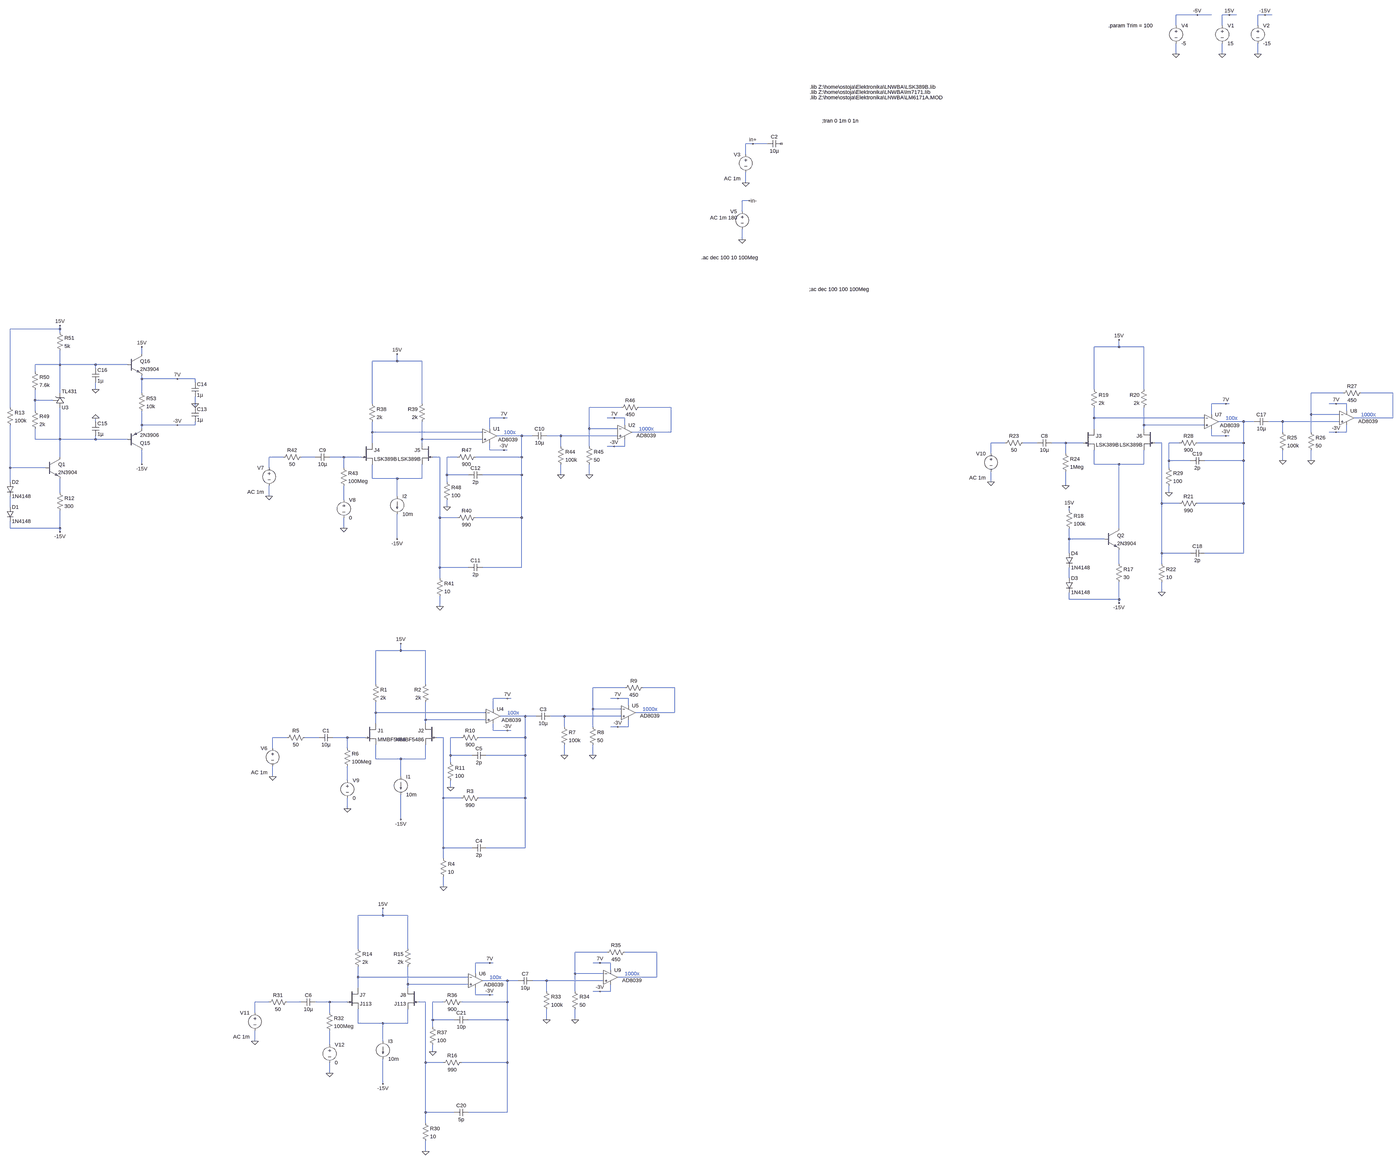
[diagram p0: schematic Figure_3.37.asc, whole sheet]
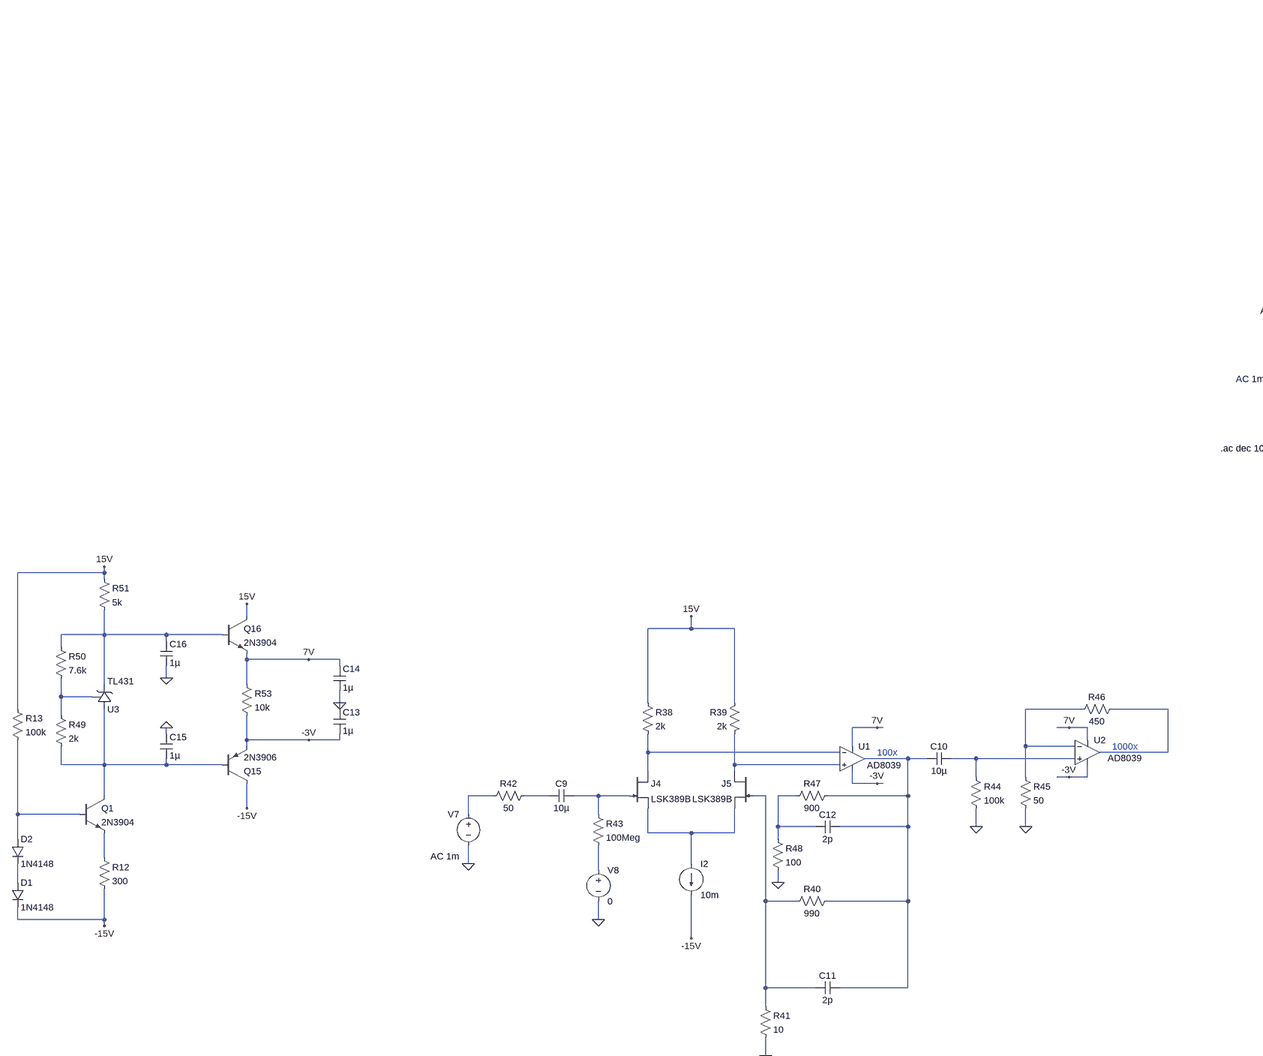
[diagram p1: schematic Figure_3.37.asc, part, row 1 of 2, column 1 of 2]
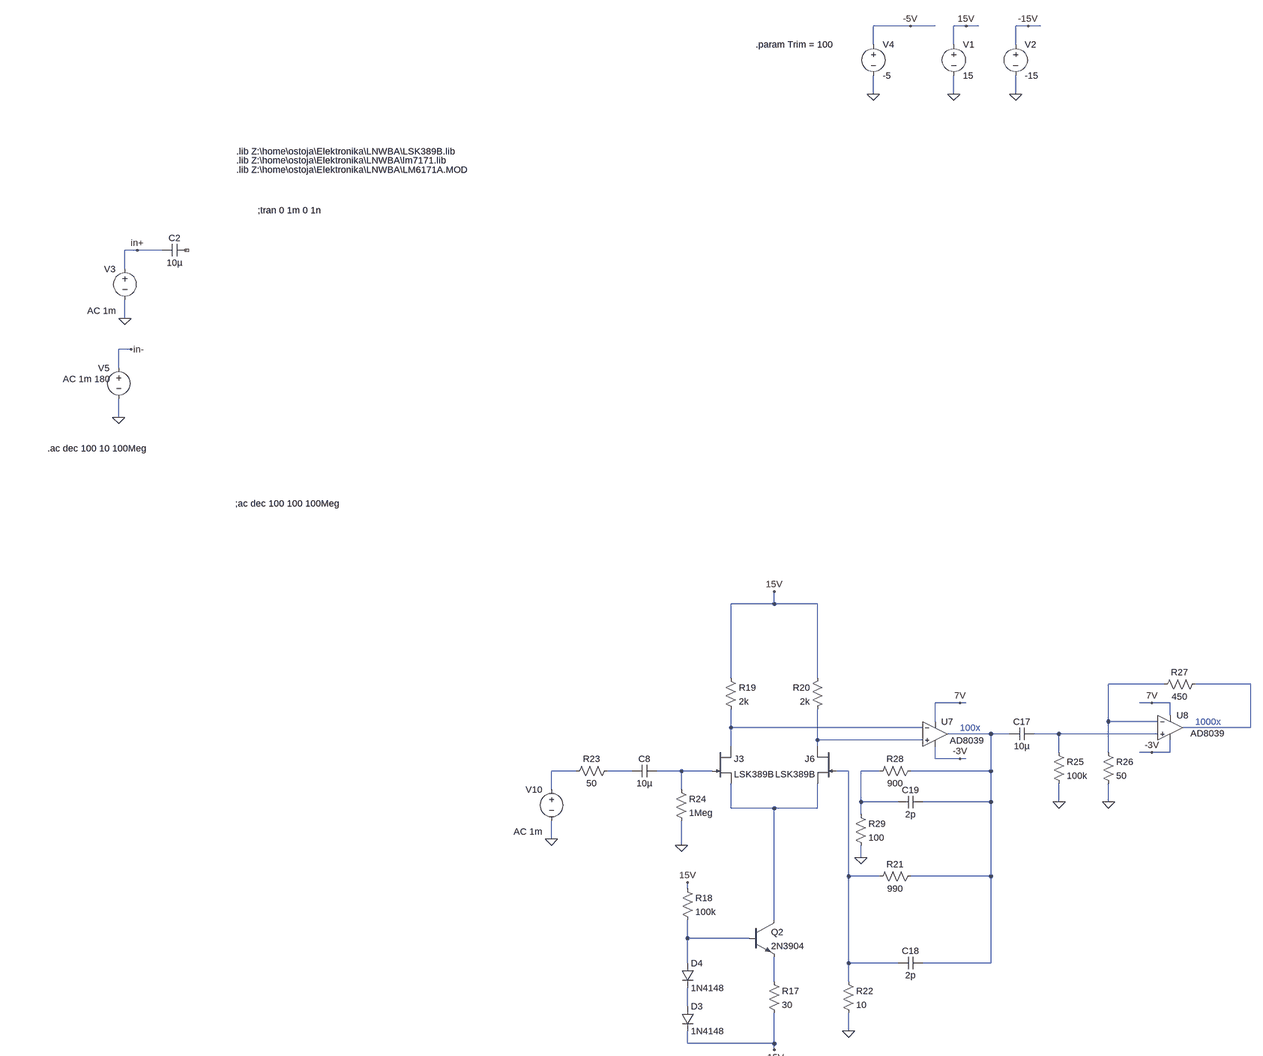
[diagram p2: schematic Figure_3.37.asc, part, row 1 of 2, column 2 of 2]
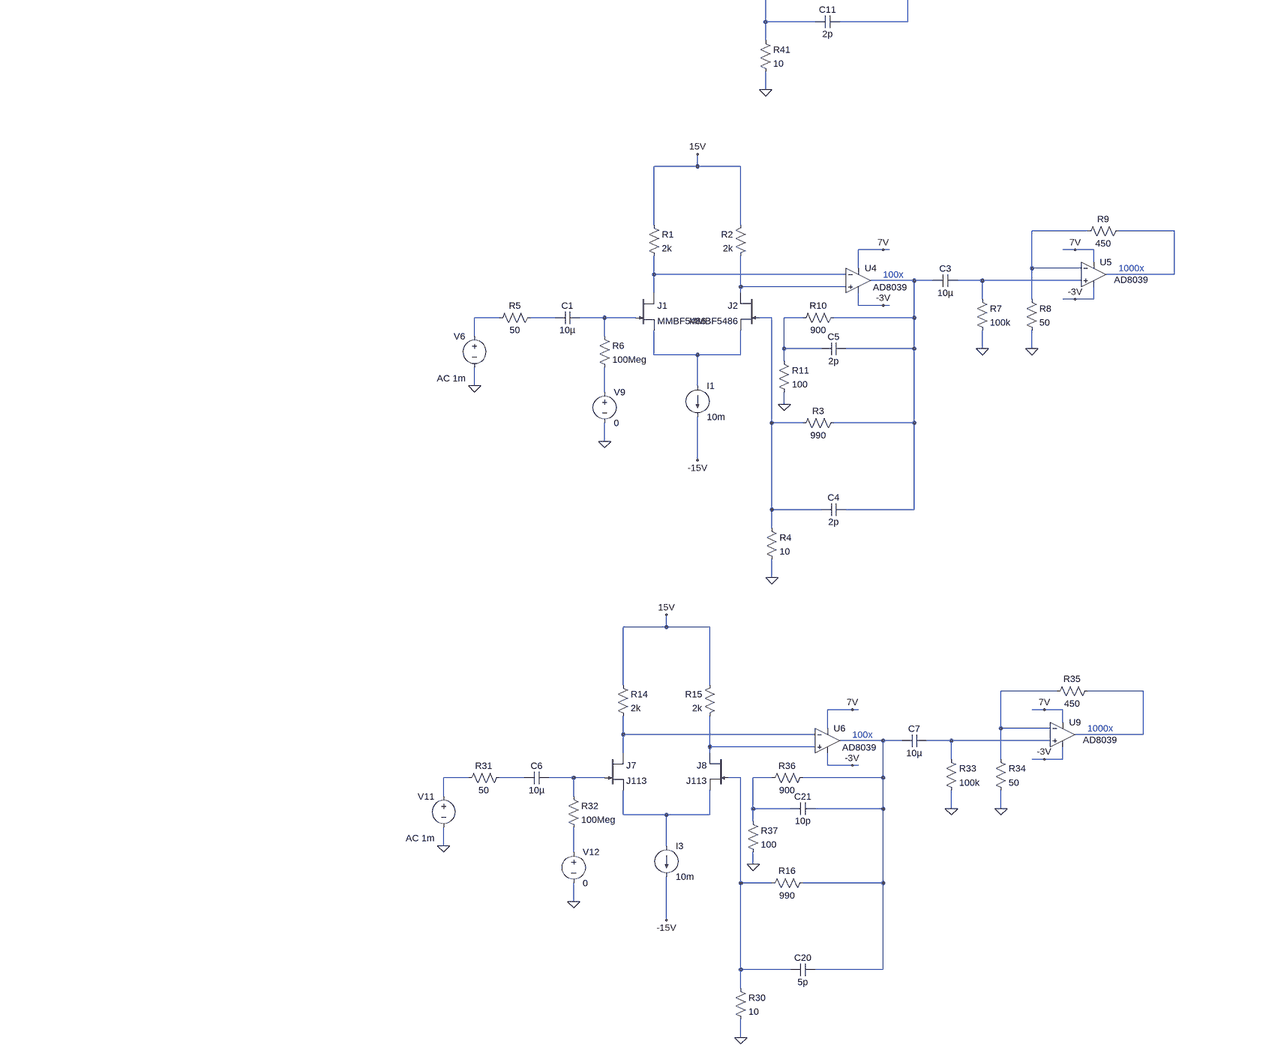
[diagram p3: schematic Figure_3.37.asc, part, row 2 of 2, column 1 of 2]
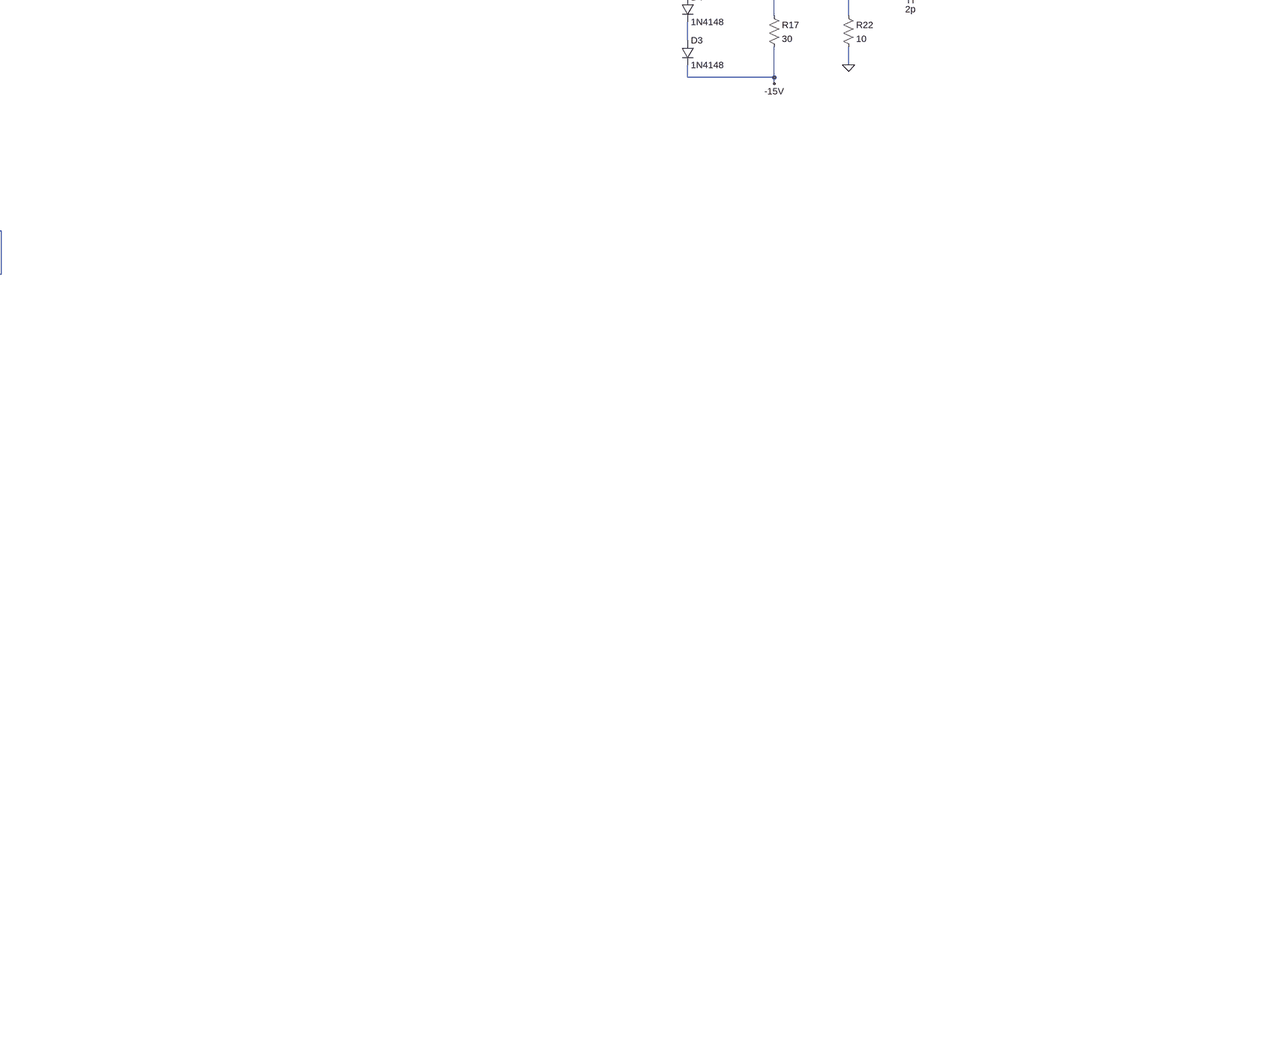
[diagram p4: schematic Figure_3.37.asc, part, row 2 of 2, column 2 of 2]
Figure_3.37.asc, the LTspice schematic file:
Version 4
SHEET 1 8100 7252
WIRE 960 -592 864 -592
WIRE 1024 -592 960 -592
WIRE 1104 -592 1072 -592
WIRE 1136 -592 1104 -592
WIRE 1264 -592 1232 -592
WIRE 1296 -592 1264 -592
WIRE 864 -544 864 -592
WIRE 1072 -544 1072 -592
WIRE 1232 -544 1232 -592
WIRE 864 -416 864 -464
WIRE 1072 -416 1072 -464
WIRE 1232 -416 1232 -464
WIRE -2000 32 -2032 32
WIRE -1936 32 -2000 32
WIRE -2032 80 -2032 32
WIRE -2032 208 -2032 160
WIRE -2016 288 -2048 288
WIRE -2048 336 -2048 288
WIRE -2048 464 -2048 416
WIRE -5424 3392 -5424 3376
WIRE -5424 3392 -5648 3392
WIRE -5424 3408 -5424 3392
WIRE 608 3472 608 3440
WIRE 608 3472 496 3472
WIRE 720 3472 608 3472
WIRE -5056 3504 -5056 3472
WIRE -3712 3536 -3712 3504
WIRE -3712 3536 -3824 3536
WIRE -3600 3536 -3712 3536
WIRE -5424 3552 -5424 3488
WIRE -5424 3552 -5536 3552
WIRE -5264 3552 -5424 3552
WIRE -5120 3552 -5264 3552
WIRE -5264 3568 -5264 3552
WIRE -5536 3584 -5536 3552
WIRE -5056 3616 -5056 3600
WIRE -4896 3616 -5056 3616
WIRE -4816 3616 -4896 3616
WIRE -4816 3632 -4816 3616
WIRE -5264 3664 -5264 3632
WIRE 496 3664 496 3472
WIRE 720 3664 720 3472
WIRE -5424 3680 -5424 3552
WIRE -5056 3680 -5056 3616
WIRE 1616 3680 1472 3680
WIRE 1840 3680 1696 3680
WIRE -5536 3712 -5536 3664
WIRE -5456 3712 -5536 3712
WIRE -4816 3728 -4816 3696
WIRE -3824 3728 -3824 3536
WIRE -3600 3728 -3600 3536
WIRE 1088 3728 1024 3728
WIRE 1104 3728 1088 3728
WIRE 1584 3728 1552 3728
WIRE 1632 3728 1584 3728
WIRE -5648 3744 -5648 3392
WIRE -4816 3744 -4816 3728
WIRE -2704 3744 -2848 3744
WIRE -2480 3744 -2624 3744
WIRE -5536 3760 -5536 3712
WIRE 1632 3760 1632 3728
WIRE 1024 3776 1024 3728
WIRE 1472 3776 1472 3680
WIRE 1600 3776 1472 3776
WIRE -3232 3792 -3296 3792
WIRE -3216 3792 -3232 3792
WIRE -2736 3792 -2768 3792
WIRE -2688 3792 -2736 3792
WIRE 496 3792 496 3744
WIRE 992 3792 496 3792
WIRE 1840 3792 1840 3680
WIRE 1840 3792 1664 3792
WIRE -5264 3808 -5264 3792
WIRE 1168 3808 1056 3808
WIRE 1216 3808 1168 3808
WIRE 1344 3808 1280 3808
WIRE 1600 3808 1344 3808
WIRE -5056 3824 -5056 3760
WIRE -4896 3824 -5056 3824
WIRE -4816 3824 -4816 3808
WIRE -4816 3824 -4896 3824
WIRE -2688 3824 -2688 3792
WIRE 720 3824 720 3744
WIRE 992 3824 720 3824
WIRE -5056 3840 -5056 3824
WIRE -3296 3840 -3296 3792
WIRE -2848 3840 -2848 3744
WIRE -2720 3840 -2848 3840
WIRE 496 3840 496 3792
WIRE 720 3840 720 3824
WIRE -3824 3856 -3824 3808
WIRE -3328 3856 -3824 3856
WIRE -2480 3856 -2480 3744
WIRE -2480 3856 -2656 3856
WIRE 1344 3856 1344 3808
WIRE 1472 3856 1472 3776
WIRE 1584 3856 1552 3856
WIRE 1632 3856 1632 3824
WIRE 1632 3856 1584 3856
WIRE -3152 3872 -3264 3872
WIRE -3104 3872 -3152 3872
WIRE -2976 3872 -3040 3872
WIRE -2720 3872 -2976 3872
WIRE 1024 3872 1024 3840
WIRE 1088 3872 1024 3872
WIRE 1104 3872 1088 3872
WIRE -5536 3888 -5536 3840
WIRE -5424 3888 -5424 3744
WIRE -5424 3888 -5536 3888
WIRE -5264 3888 -5264 3872
WIRE -5264 3888 -5424 3888
WIRE -5120 3888 -5264 3888
WIRE -3600 3888 -3600 3808
WIRE -3328 3888 -3600 3888
WIRE -3824 3904 -3824 3856
WIRE -3600 3904 -3600 3888
WIRE 96 3904 32 3904
WIRE 240 3904 176 3904
WIRE 368 3904 304 3904
WIRE 448 3904 368 3904
WIRE 800 3904 768 3904
WIRE 880 3904 832 3904
WIRE 1168 3904 1168 3808
WIRE 1168 3904 960 3904
WIRE -2976 3920 -2976 3872
WIRE -2848 3920 -2848 3840
WIRE -2736 3920 -2768 3920
WIRE -2688 3920 -2688 3888
WIRE -2688 3920 -2736 3920
WIRE -3296 3936 -3296 3904
WIRE -3232 3936 -3296 3936
WIRE -3216 3936 -3232 3936
WIRE 32 3952 32 3904
WIRE 368 3952 368 3904
WIRE -5424 3968 -5424 3888
WIRE -4224 3968 -4288 3968
WIRE -4080 3968 -4144 3968
WIRE -3952 3968 -4016 3968
WIRE -3872 3968 -3952 3968
WIRE -3520 3968 -3552 3968
WIRE -3440 3968 -3488 3968
WIRE -3152 3968 -3152 3872
WIRE -3152 3968 -3360 3968
WIRE 832 3984 832 3904
WIRE 928 3984 832 3984
WIRE 1168 3984 1168 3904
WIRE 1168 3984 992 3984
WIRE 1344 3984 1344 3936
WIRE 1472 3984 1472 3936
WIRE -5056 4000 -5056 3936
WIRE 496 4000 496 3936
WIRE 608 4000 496 4000
WIRE 720 4000 720 3936
WIRE 720 4000 608 4000
WIRE -5648 4016 -5648 3824
WIRE -5488 4016 -5648 4016
WIRE -4288 4016 -4288 3968
WIRE -3952 4016 -3952 3968
WIRE 832 4016 832 3984
WIRE -3488 4048 -3488 3968
WIRE -3392 4048 -3488 4048
WIRE -3152 4048 -3152 3968
WIRE -3152 4048 -3328 4048
WIRE -2976 4048 -2976 4000
WIRE -2848 4048 -2848 4000
WIRE -3824 4064 -3824 4000
WIRE -3712 4064 -3824 4064
WIRE -3600 4064 -3600 4000
WIRE -3600 4064 -3712 4064
WIRE -5648 4080 -5648 4016
WIRE -3488 4080 -3488 4048
WIRE 32 4080 32 4032
WIRE 368 4096 368 4032
WIRE -5424 4128 -5424 4064
WIRE 832 4128 832 4096
WIRE -4288 4144 -4288 4096
WIRE -3712 4144 -3712 4064
WIRE -3952 4160 -3952 4096
WIRE 800 4176 800 3904
WIRE 880 4176 800 4176
WIRE 1168 4176 1168 3984
WIRE 1168 4176 960 4176
WIRE -5648 4192 -5648 4144
WIRE -3488 4192 -3488 4160
WIRE 384 4208 384 4192
WIRE -3520 4240 -3520 3968
WIRE -3440 4240 -3520 4240
WIRE -3152 4240 -3152 4048
WIRE -3152 4240 -3360 4240
WIRE -5648 4288 -5648 4256
WIRE -5424 4288 -5424 4208
WIRE -5424 4288 -5648 4288
WIRE -3952 4288 -3952 4240
WIRE 608 4288 608 4000
WIRE -5424 4304 -5424 4288
WIRE -3712 4336 -3712 4224
WIRE 384 4336 384 4288
WIRE 544 4336 384 4336
WIRE 384 4400 384 4336
WIRE 800 4400 800 4176
WIRE 928 4400 800 4400
WIRE 1168 4400 1168 4176
WIRE 1168 4400 992 4400
WIRE 608 4448 608 4384
WIRE 800 4448 800 4400
WIRE -3520 4464 -3520 4240
WIRE -3392 4464 -3520 4464
WIRE -3152 4464 -3152 4240
WIRE -3152 4464 -3328 4464
WIRE -3520 4512 -3520 4464
WIRE 384 4512 384 4464
WIRE 800 4576 800 4528
WIRE 384 4608 384 4576
WIRE 608 4608 608 4528
WIRE 608 4608 384 4608
WIRE 608 4624 608 4608
WIRE -3520 4640 -3520 4592
WIRE -3696 4896 -3696 4864
WIRE -3696 4896 -3808 4896
WIRE -3584 4896 -3696 4896
WIRE -3808 5088 -3808 4896
WIRE -3584 5088 -3584 4896
WIRE -2688 5104 -2832 5104
WIRE -2464 5104 -2608 5104
WIRE -3216 5152 -3280 5152
WIRE -3200 5152 -3216 5152
WIRE -2720 5152 -2752 5152
WIRE -2672 5152 -2720 5152
WIRE -2672 5184 -2672 5152
WIRE -3280 5200 -3280 5152
WIRE -2832 5200 -2832 5104
WIRE -2704 5200 -2832 5200
WIRE -3808 5216 -3808 5168
WIRE -3312 5216 -3808 5216
WIRE -2464 5216 -2464 5104
WIRE -2464 5216 -2640 5216
WIRE -3136 5232 -3248 5232
WIRE -3088 5232 -3136 5232
WIRE -2960 5232 -3024 5232
WIRE -2704 5232 -2960 5232
WIRE -3584 5248 -3584 5168
WIRE -3312 5248 -3584 5248
WIRE -3808 5264 -3808 5216
WIRE -3584 5264 -3584 5248
WIRE -2960 5280 -2960 5232
WIRE -2832 5280 -2832 5200
WIRE -2720 5280 -2752 5280
WIRE -2672 5280 -2672 5248
WIRE -2672 5280 -2720 5280
WIRE -3280 5296 -3280 5264
WIRE -3216 5296 -3280 5296
WIRE -3200 5296 -3216 5296
WIRE -4208 5328 -4272 5328
WIRE -4064 5328 -4128 5328
WIRE -3936 5328 -4000 5328
WIRE -3856 5328 -3936 5328
WIRE -3504 5328 -3536 5328
WIRE -3424 5328 -3472 5328
WIRE -3136 5328 -3136 5232
WIRE -3136 5328 -3344 5328
WIRE -4272 5376 -4272 5328
WIRE -3936 5376 -3936 5328
WIRE -3472 5408 -3472 5328
WIRE -3376 5408 -3472 5408
WIRE -3136 5408 -3136 5328
WIRE -3136 5408 -3312 5408
WIRE -2960 5408 -2960 5360
WIRE -2832 5408 -2832 5360
WIRE -3808 5424 -3808 5360
WIRE -3696 5424 -3808 5424
WIRE -3584 5424 -3584 5360
WIRE -3584 5424 -3696 5424
WIRE -3472 5440 -3472 5408
WIRE -4272 5504 -4272 5456
WIRE -3696 5504 -3696 5424
WIRE -3936 5520 -3936 5456
WIRE -3472 5552 -3472 5520
WIRE -3504 5600 -3504 5328
WIRE -3424 5600 -3504 5600
WIRE -3136 5600 -3136 5408
WIRE -3136 5600 -3344 5600
WIRE -3936 5648 -3936 5600
WIRE -3696 5696 -3696 5584
WIRE -3504 5824 -3504 5600
WIRE -3376 5824 -3504 5824
WIRE -3136 5824 -3136 5600
WIRE -3136 5824 -3312 5824
WIRE -3504 5872 -3504 5824
WIRE -3504 6000 -3504 5952
WIRE -3776 6128 -3776 6096
WIRE -3776 6128 -3888 6128
WIRE -3664 6128 -3776 6128
WIRE -3888 6320 -3888 6128
WIRE -3664 6320 -3664 6128
WIRE -2768 6336 -2912 6336
WIRE -2544 6336 -2688 6336
WIRE -3296 6384 -3360 6384
WIRE -3280 6384 -3296 6384
WIRE -2800 6384 -2832 6384
WIRE -2752 6384 -2800 6384
WIRE -2752 6416 -2752 6384
WIRE -3360 6432 -3360 6384
WIRE -2912 6432 -2912 6336
WIRE -2784 6432 -2912 6432
WIRE -3888 6448 -3888 6400
WIRE -3392 6448 -3888 6448
WIRE -2544 6448 -2544 6336
WIRE -2544 6448 -2720 6448
WIRE -3216 6464 -3328 6464
WIRE -3168 6464 -3216 6464
WIRE -3040 6464 -3104 6464
WIRE -2784 6464 -3040 6464
WIRE -3664 6480 -3664 6400
WIRE -3392 6480 -3664 6480
WIRE -3888 6496 -3888 6448
WIRE -3664 6496 -3664 6480
WIRE -3040 6512 -3040 6464
WIRE -2912 6512 -2912 6432
WIRE -2800 6512 -2832 6512
WIRE -2752 6512 -2752 6480
WIRE -2752 6512 -2800 6512
WIRE -3360 6528 -3360 6496
WIRE -3296 6528 -3360 6528
WIRE -3280 6528 -3296 6528
WIRE -4288 6560 -4352 6560
WIRE -4144 6560 -4208 6560
WIRE -4016 6560 -4080 6560
WIRE -3936 6560 -4016 6560
WIRE -3584 6560 -3616 6560
WIRE -3504 6560 -3552 6560
WIRE -3216 6560 -3216 6464
WIRE -3216 6560 -3424 6560
WIRE -4352 6608 -4352 6560
WIRE -4016 6608 -4016 6560
WIRE -3552 6640 -3552 6560
WIRE -3456 6640 -3552 6640
WIRE -3216 6640 -3216 6560
WIRE -3216 6640 -3392 6640
WIRE -3040 6640 -3040 6592
WIRE -2912 6640 -2912 6592
WIRE -3888 6656 -3888 6592
WIRE -3776 6656 -3888 6656
WIRE -3664 6656 -3664 6592
WIRE -3664 6656 -3776 6656
WIRE -3552 6672 -3552 6640
WIRE -4352 6736 -4352 6688
WIRE -3776 6736 -3776 6656
WIRE -4016 6752 -4016 6688
WIRE -3552 6784 -3552 6752
WIRE -3584 6832 -3584 6560
WIRE -3504 6832 -3584 6832
WIRE -3216 6832 -3216 6640
WIRE -3216 6832 -3424 6832
WIRE -4016 6880 -4016 6832
WIRE -3776 6928 -3776 6816
WIRE -3584 7056 -3584 6832
WIRE -3456 7056 -3584 7056
WIRE -3216 7056 -3216 6832
WIRE -3216 7056 -3392 7056
WIRE -3584 7104 -3584 7056
WIRE -3584 7232 -3584 7184
FLAG 1104 -592 15V
FLAG 1264 -592 -15V
FLAG 1232 -416 0
FLAG 1072 -416 0
FLAG 960 -592 -5V
FLAG 864 -416 0
FLAG -2032 208 0
FLAG -2000 32 in+
FLAG -2048 464 0
FLAG -2016 288 in-
FLAG -3712 3504 15V
FLAG -3712 4336 -15V
FLAG -4288 4144 0
FLAG -3520 4640 0
FLAG -2976 4048 0
FLAG -3952 4288 0
FLAG -3232 3792 7V
FLAG -3232 3936 -3V
FLAG -2848 4048 0
FLAG -3488 4192 0
FLAG -5424 3376 15V
FLAG -5424 4304 -15V
FLAG -5056 4000 -15V
FLAG -5056 3472 15V
FLAG -4896 3616 7V
FLAG -4896 3824 -3V
FLAG -4816 3728 0
FLAG -5264 3792 0
FLAG -5264 3664 0
FLAG -2736 3792 7V
FLAG -2736 3920 -3V
FLAG -3696 4864 15V
FLAG -3696 5696 -15V
FLAG -4272 5504 0
FLAG -3504 6000 0
FLAG -2960 5408 0
FLAG -3936 5648 0
FLAG -3216 5152 7V
FLAG -3216 5296 -3V
FLAG -2832 5408 0
FLAG -3472 5552 0
FLAG -2720 5152 7V
FLAG -2720 5280 -3V
FLAG 384 4192 15V
FLAG 608 4624 -15V
FLAG 608 3440 15V
FLAG 32 4080 0
FLAG 800 4576 0
FLAG 1344 3984 0
FLAG 368 4096 0
FLAG 1088 3728 7V
FLAG 1088 3872 -3V
FLAG 1472 3984 0
FLAG 832 4128 0
FLAG 1584 3728 7V
FLAG 1584 3856 -3V
FLAG -3776 6096 15V
FLAG -3776 6928 -15V
FLAG -4352 6736 0
FLAG -3584 7232 0
FLAG -3040 6640 0
FLAG -4016 6880 0
FLAG -3296 6384 7V
FLAG -3296 6528 -3V
FLAG -2912 6640 0
FLAG -3552 6784 0
FLAG -2800 6384 7V
FLAG -2800 6512 -3V
SYMBOL voltage 1072 -560 R0
WINDOW 123 0 0 Left 0
WINDOW 39 0 0 Left 0
SYMATTR InstName V1
SYMATTR Value 15
SYMBOL voltage 1232 -560 R0
WINDOW 123 0 0 Left 0
WINDOW 39 0 0 Left 0
SYMATTR InstName V2
SYMATTR Value -15
SYMBOL voltage 864 -560 R0
WINDOW 123 0 0 Left 0
WINDOW 39 0 0 Left 0
SYMATTR InstName V4
SYMATTR Value -5
SYMBOL voltage -2032 64 M0
WINDOW 123 24 124 Left 2
WINDOW 39 0 0 Left 0
SYMATTR Value2 AC 1m
SYMATTR InstName V3
SYMATTR Value ""
SYMBOL cap -1872 16 R90
WINDOW 0 0 32 VBottom 2
WINDOW 3 32 32 VTop 2
SYMATTR InstName C2
SYMATTR Value 10µ
SYMBOL voltage -2048 320 M0
WINDOW 123 24 44 Left 2
WINDOW 39 0 0 Left 0
SYMATTR Value2 AC 1m 180
SYMATTR InstName V5
SYMATTR Value ""
SYMBOL njf -3872 3904 R0
SYMATTR InstName J4
SYMATTR Value LSK389B
SYMBOL voltage -4288 4000 M0
WINDOW 123 24 124 Left 2
WINDOW 39 0 0 Left 0
SYMATTR Value2 AC 1m
SYMATTR InstName V7
SYMATTR Value ""
SYMBOL res -3840 3712 R0
SYMATTR InstName R38
SYMATTR Value 2k
SYMBOL njf -3552 3904 M0
SYMATTR InstName J5
SYMATTR Value LSK389B
SYMBOL res -3584 3712 M0
SYMATTR InstName R39
SYMATTR Value 2k
SYMBOL res -3344 4224 R90
WINDOW 0 0 56 VBottom 2
WINDOW 3 32 56 VTop 2
SYMATTR InstName R40
SYMATTR Value 990
SYMBOL res -3536 4496 R0
SYMATTR InstName R41
SYMATTR Value 10
SYMBOL cap -4016 3952 R90
WINDOW 0 0 32 VBottom 2
WINDOW 3 32 32 VTop 2
SYMATTR InstName C9
SYMATTR Value 10µ
SYMBOL res -4128 3952 R90
WINDOW 0 0 56 VBottom 2
WINDOW 3 32 56 VTop 2
SYMATTR InstName R42
SYMATTR Value 50
SYMBOL res -3968 4000 R0
SYMATTR InstName R43
SYMATTR Value 100Meg
SYMBOL cap -3040 3856 R90
WINDOW 0 0 32 VBottom 2
WINDOW 3 32 32 VTop 2
SYMATTR InstName C10
SYMATTR Value 10µ
SYMBOL res -2992 3904 R0
SYMATTR InstName R44
SYMATTR Value 100k
SYMBOL voltage -3952 4144 R0
WINDOW 123 0 0 Left 0
WINDOW 39 0 0 Left 0
SYMATTR InstName V8
SYMATTR Value 0
SYMBOL current -3712 4144 R0
WINDOW 123 0 0 Left 0
WINDOW 39 0 0 Left 0
SYMATTR InstName I2
SYMATTR Value 10m
SYMBOL OpAmps\\AD8039 -3296 3808 R0
WINDOW 3 38 81 Left 2
SYMATTR InstName U1
SYMBOL cap -3328 4448 R90
WINDOW 0 0 32 VBottom 2
WINDOW 3 32 32 VTop 2
SYMATTR InstName C11
SYMATTR Value 2p
SYMBOL OpAmps\\AD8039 -2688 3792 R0
WINDOW 3 52 78 Left 2
SYMATTR InstName U2
SYMBOL res -2864 3904 R0
SYMATTR InstName R45
SYMATTR Value 50
SYMBOL res -2608 3728 R90
WINDOW 0 0 56 VBottom 2
WINDOW 3 32 56 VTop 2
SYMATTR InstName R46
SYMATTR Value 450
SYMBOL res -3344 3952 R90
WINDOW 0 0 56 VBottom 2
WINDOW 3 32 56 VTop 2
SYMATTR InstName R47
SYMATTR Value 900
SYMBOL res -3504 4064 R0
SYMATTR InstName R48
SYMATTR Value 100
SYMBOL cap -3328 4032 R90
WINDOW 0 0 32 VBottom 2
WINDOW 3 32 32 VTop 2
SYMATTR InstName C12
SYMATTR Value 2p
SYMBOL ZZZ\\REF\\TL431 -5440 3680 R0
SYMATTR InstName U3
SYMBOL res -5552 3744 R0
SYMATTR InstName R49
SYMATTR Value 2k
SYMBOL res -5552 3568 R0
SYMATTR InstName R50
SYMATTR Value 7.6k
SYMBOL res -5440 3392 R0
SYMATTR InstName R51
SYMATTR Value 5k
SYMBOL pnp -5120 3936 M180
SYMATTR InstName Q15
SYMATTR Value 2N3906
SYMBOL res -5072 3664 R0
SYMATTR InstName R53
SYMATTR Value 10k
SYMBOL npn -5120 3504 R0
SYMATTR InstName Q16
SYMATTR Value 2N3904
SYMBOL cap -4832 3744 R0
SYMATTR InstName C13
SYMATTR Value 1µ
SYMBOL cap -4832 3632 R0
SYMATTR InstName C14
SYMATTR Value 1µ
SYMBOL cap -5280 3808 R0
SYMATTR InstName C15
SYMATTR Value 1µ
SYMBOL cap -5280 3568 R0
SYMATTR InstName C16
SYMATTR Value 1µ
SYMBOL njf -3856 5264 R0
SYMATTR InstName J1
SYMATTR Value MMBF5486
SYMBOL voltage -4272 5360 M0
WINDOW 123 24 124 Left 2
WINDOW 39 0 0 Left 0
SYMATTR Value2 AC 1m
SYMATTR InstName V6
SYMATTR Value ""
SYMBOL res -3824 5072 R0
SYMATTR InstName R1
SYMATTR Value 2k
SYMBOL res -3568 5072 M0
SYMATTR InstName R2
SYMATTR Value 2k
SYMBOL res -3328 5584 R90
WINDOW 0 0 56 VBottom 2
WINDOW 3 32 56 VTop 2
SYMATTR InstName R3
SYMATTR Value 990
SYMBOL res -3520 5856 R0
SYMATTR InstName R4
SYMATTR Value 10
SYMBOL cap -4000 5312 R90
WINDOW 0 0 32 VBottom 2
WINDOW 3 32 32 VTop 2
SYMATTR InstName C1
SYMATTR Value 10µ
SYMBOL res -4112 5312 R90
WINDOW 0 0 56 VBottom 2
WINDOW 3 32 56 VTop 2
SYMATTR InstName R5
SYMATTR Value 50
SYMBOL res -3952 5360 R0
SYMATTR InstName R6
SYMATTR Value 100Meg
SYMBOL cap -3024 5216 R90
WINDOW 0 0 32 VBottom 2
WINDOW 3 32 32 VTop 2
SYMATTR InstName C3
SYMATTR Value 10µ
SYMBOL res -2976 5264 R0
SYMATTR InstName R7
SYMATTR Value 100k
SYMBOL voltage -3936 5504 R0
WINDOW 123 0 0 Left 0
WINDOW 39 0 0 Left 0
SYMATTR InstName V9
SYMATTR Value 0
SYMBOL current -3696 5504 R0
WINDOW 123 0 0 Left 0
WINDOW 39 0 0 Left 0
SYMATTR InstName I1
SYMATTR Value 10m
SYMBOL OpAmps\\AD8039 -3280 5168 R0
WINDOW 3 38 81 Left 2
SYMATTR InstName U4
SYMBOL cap -3312 5808 R90
WINDOW 0 0 32 VBottom 2
WINDOW 3 32 32 VTop 2
SYMATTR InstName C4
SYMATTR Value 2p
SYMBOL OpAmps\\AD8039 -2672 5152 R0
WINDOW 3 52 78 Left 2
SYMATTR InstName U5
SYMBOL res -2848 5264 R0
SYMATTR InstName R8
SYMATTR Value 50
SYMBOL res -2592 5088 R90
WINDOW 0 0 56 VBottom 2
WINDOW 3 32 56 VTop 2
SYMATTR InstName R9
SYMATTR Value 450
SYMBOL res -3328 5312 R90
WINDOW 0 0 56 VBottom 2
WINDOW 3 32 56 VTop 2
SYMATTR InstName R10
SYMATTR Value 900
SYMBOL res -3488 5424 R0
SYMATTR InstName R11
SYMATTR Value 100
SYMBOL cap -3312 5392 R90
WINDOW 0 0 32 VBottom 2
WINDOW 3 32 32 VTop 2
SYMATTR InstName C5
SYMATTR Value 2p
SYMBOL njf -3536 5264 M0
SYMATTR InstName J2
SYMATTR Value MMBF5486
SYMBOL npn -5488 3968 R0
SYMATTR InstName Q1
SYMATTR Value 2N3904
SYMBOL diode -5664 4192 R0
SYMATTR InstName D1
SYMATTR Value 1N4148
SYMBOL diode -5664 4080 R0
SYMATTR InstName D2
SYMATTR Value 1N4148
SYMBOL res -5440 4112 R0
SYMATTR InstName R12
SYMATTR Value 300
SYMBOL res -5664 3728 R0
SYMATTR InstName R13
SYMATTR Value 100k
SYMBOL npn 544 4288 R0
SYMATTR InstName Q2
SYMATTR Value 2N3904
SYMBOL diode 368 4512 R0
SYMATTR InstName D3
SYMATTR Value 1N4148
SYMBOL diode 368 4400 R0
SYMATTR InstName D4
SYMATTR Value 1N4148
SYMBOL res 592 4432 R0
SYMATTR InstName R17
SYMATTR Value 30
SYMBOL res 368 4192 R0
SYMATTR InstName R18
SYMATTR Value 100k
SYMBOL njf 448 3840 R0
SYMATTR InstName J3
SYMATTR Value LSK389B
SYMBOL voltage 32 3936 M0
WINDOW 123 24 124 Left 2
WINDOW 39 0 0 Left 0
SYMATTR Value2 AC 1m
SYMATTR InstName V10
SYMATTR Value ""
SYMBOL res 480 3648 R0
SYMATTR InstName R19
SYMATTR Value 2k
SYMBOL njf 768 3840 M0
SYMATTR InstName J6
SYMATTR Value LSK389B
SYMBOL res 736 3648 M0
SYMATTR InstName R20
SYMATTR Value 2k
SYMBOL res 976 4160 R90
WINDOW 0 0 56 VBottom 2
WINDOW 3 32 56 VTop 2
SYMATTR InstName R21
SYMATTR Value 990
SYMBOL res 784 4432 R0
SYMATTR InstName R22
SYMATTR Value 10
SYMBOL cap 304 3888 R90
WINDOW 0 0 32 VBottom 2
WINDOW 3 32 32 VTop 2
SYMATTR InstName C8
SYMATTR Value 10µ
SYMBOL res 192 3888 R90
WINDOW 0 0 56 VBottom 2
WINDOW 3 32 56 VTop 2
SYMATTR InstName R23
SYMATTR Value 50
SYMBOL res 352 3936 R0
SYMATTR InstName R24
SYMATTR Value 1Meg
SYMBOL cap 1280 3792 R90
WINDOW 0 0 32 VBottom 2
WINDOW 3 32 32 VTop 2
SYMATTR InstName C17
SYMATTR Value 10µ
SYMBOL res 1328 3840 R0
SYMATTR InstName R25
SYMATTR Value 100k
SYMBOL OpAmps\\AD8039 1024 3744 R0
WINDOW 3 38 81 Left 2
SYMATTR InstName U7
SYMBOL cap 992 4384 R90
WINDOW 0 0 32 VBottom 2
WINDOW 3 32 32 VTop 2
SYMATTR InstName C18
SYMATTR Value 2p
SYMBOL OpAmps\\AD8039 1632 3728 R0
WINDOW 3 52 78 Left 2
SYMATTR InstName U8
SYMBOL res 1456 3840 R0
SYMATTR InstName R26
SYMATTR Value 50
SYMBOL res 1712 3664 R90
WINDOW 0 0 56 VBottom 2
WINDOW 3 32 56 VTop 2
SYMATTR InstName R27
SYMATTR Value 450
SYMBOL res 976 3888 R90
WINDOW 0 0 56 VBottom 2
WINDOW 3 32 56 VTop 2
SYMATTR InstName R28
SYMATTR Value 900
SYMBOL res 816 4000 R0
SYMATTR InstName R29
SYMATTR Value 100
SYMBOL cap 992 3968 R90
WINDOW 0 0 32 VBottom 2
WINDOW 3 32 32 VTop 2
SYMATTR InstName C19
SYMATTR Value 2p
SYMBOL njf -3936 6496 R0
SYMATTR InstName J7
SYMATTR Value J113
SYMBOL voltage -4352 6592 M0
WINDOW 123 24 124 Left 2
WINDOW 39 0 0 Left 0
SYMATTR Value2 AC 1m
SYMATTR InstName V11
SYMATTR Value ""
SYMBOL res -3904 6304 R0
SYMATTR InstName R14
SYMATTR Value 2k
SYMBOL res -3648 6304 M0
SYMATTR InstName R15
SYMATTR Value 2k
SYMBOL res -3408 6816 R90
WINDOW 0 0 56 VBottom 2
WINDOW 3 32 56 VTop 2
SYMATTR InstName R16
SYMATTR Value 990
SYMBOL res -3600 7088 R0
SYMATTR InstName R30
SYMATTR Value 10
SYMBOL cap -4080 6544 R90
WINDOW 0 0 32 VBottom 2
WINDOW 3 32 32 VTop 2
SYMATTR InstName C6
SYMATTR Value 10µ
SYMBOL res -4192 6544 R90
WINDOW 0 0 56 VBottom 2
WINDOW 3 32 56 VTop 2
SYMATTR InstName R31
SYMATTR Value 50
SYMBOL res -4032 6592 R0
SYMATTR InstName R32
SYMATTR Value 100Meg
SYMBOL cap -3104 6448 R90
WINDOW 0 0 32 VBottom 2
WINDOW 3 32 32 VTop 2
SYMATTR InstName C7
SYMATTR Value 10µ
SYMBOL res -3056 6496 R0
SYMATTR InstName R33
SYMATTR Value 100k
SYMBOL voltage -4016 6736 R0
WINDOW 123 0 0 Left 0
WINDOW 39 0 0 Left 0
SYMATTR InstName V12
SYMATTR Value 0
SYMBOL current -3776 6736 R0
WINDOW 123 0 0 Left 0
WINDOW 39 0 0 Left 0
SYMATTR InstName I3
SYMATTR Value 10m
SYMBOL OpAmps\\AD8039 -3360 6400 R0
WINDOW 3 38 81 Left 2
SYMATTR InstName U6
SYMBOL cap -3392 7040 R90
WINDOW 0 0 32 VBottom 2
WINDOW 3 32 32 VTop 2
SYMATTR InstName C20
SYMATTR Value 5p
SYMBOL OpAmps\\AD8039 -2752 6384 R0
WINDOW 3 52 78 Left 2
SYMATTR InstName U9
SYMBOL res -2928 6496 R0
SYMATTR InstName R34
SYMATTR Value 50
SYMBOL res -2672 6320 R90
WINDOW 0 0 56 VBottom 2
WINDOW 3 32 56 VTop 2
SYMATTR InstName R35
SYMATTR Value 450
SYMBOL res -3408 6544 R90
WINDOW 0 0 56 VBottom 2
WINDOW 3 32 56 VTop 2
SYMATTR InstName R36
SYMATTR Value 900
SYMBOL res -3568 6656 R0
SYMATTR InstName R37
SYMATTR Value 100
SYMBOL cap -3392 6624 R90
WINDOW 0 0 32 VBottom 2
WINDOW 3 32 32 VTop 2
SYMATTR InstName C21
SYMATTR Value 10p
SYMBOL njf -3616 6496 M0
SYMATTR InstName J8
SYMATTR Value J113
TEXT -1192 -224 Left 2 !.lib Z:\\home\\ostoja\\Elektronika\\LNWBA\\LSK389B.lib
TEXT -1136 -72 Left 2 !;tran 0 1m 0 1n
TEXT -1192 -200 Left 2 !.lib Z:\\home\\ostoja\\Elektronika\\LNWBA\\lm7171.lib
TEXT -1192 -176 Left 2 !.lib Z:\\home\\ostoja\\Elektronika\\LNWBA\\LM6171A.MOD
TEXT 560 -544 Left 2 !.param Trim = 100
TEXT -1194 1240 Left 2 !;ac dec 100 100 100Meg
TEXT -2232 544 Left 2 !.ac dec 100 10 100Meg
TEXT -3232 3856 Left 2 ;100x
TEXT -2624 3840 Left 2 ;1000x
TEXT -3216 5216 Left 2 ;100x
TEXT -2608 5200 Left 2 ;1000x
TEXT 1088 3792 Left 2 ;100x
TEXT 1696 3776 Left 2 ;1000x
TEXT -3296 6448 Left 2 ;100x
TEXT -2688 6432 Left 2 ;1000x

The netlist it stands for:
* Figure_3.37.asc
V1 15V 0 15
V2 -15V 0 -15
V4 -5V 0 -5
V3 in+ 0 AC 1m
C2 NC_01 in+ 10µ
V5 in- 0 AC 1m 180
J4 N011 N023 N028 LSK389B
V7 N021 0 AC 1m
R38 15V N011 2k
J5 N015 N024 N028 LSK389B
R39 15V N015 2k
R40 N012 N024 990
R41 N024 0 10
C9 N023 N022 10µ
R42 N022 N021 50
R43 N023 N030 100Meg
C10 N013 N012 10µ
R44 N013 0 100k
V8 N030 0 0
I2 N028 -15V 10m
XU1 N015 N011 7V -3V N012 AD8039  ; pins In+ In- V+ V- OUT
C11 N012 N024 2p
XU2 N013 N005 7V -3V N006 AD8039  ; pins In+ In- V+ V- OUT
R45 N005 0 50
R46 N006 N005 450
R47 N012 N025 900
R48 N025 0 100
C12 N012 N025 2p
XU3 N004 N014 N001 TL431  ; pins R A K
R49 N004 N014 2k
R50 N001 N004 7.6k
R51 15V N001 5k
Q15 -15V N014 -3V 0 2N3906
R53 7V -3V 10k
Q16 15V N001 7V 0 2N3904
C13 0 -3V 1µ
C14 7V 0 1µ
C15 0 N014 1µ
C16 N001 0 1µ
J1 N037 N043 N046 MMBF5486
V6 N041 0 AC 1m
R1 15V N037 2k
R2 15V N040 2k
R3 N038 N044 990
R4 N044 0 10
C1 N043 N042 10µ
R5 N042 N041 50
R6 N043 N047 100Meg
C3 N039 N038 10µ
R7 N039 0 100k
V9 N047 0 0
I1 N046 -15V 10m
XU4 N040 N037 7V -3V N038 AD8039  ; pins In+ In- V+ V- OUT
C4 N038 N044 2p
XU5 N039 N035 7V -3V N036 AD8039  ; pins In+ In- V+ V- OUT
R8 N035 0 50
R9 N036 N035 450
R10 N038 N045 900
R11 N045 0 100
C5 N038 N045 2p
J2 N040 N044 N046 MMBF5486
Q1 N014 N027 N029 0 2N3904
D1 N031 -15V 1N4148
D2 N027 N031 1N4148
R12 N029 -15V 300
R13 15V N027 100k
Q2 N026 N032 N033 0 2N3904
D3 N034 -15V 1N4148
D4 N032 N034 1N4148
R17 N033 -15V 30
R18 15V N032 100k
J3 N007 N018 N026 LSK389B
V10 N016 0 AC 1m
R19 15V N007 2k
J6 N010 N019 N026 LSK389B
R20 15V N010 2k
R21 N008 N019 990
R22 N019 0 10
C8 N018 N017 10µ
R23 N017 N016 50
R24 N018 0 1Meg
C17 N009 N008 10µ
R25 N009 0 100k
XU7 N010 N007 7V -3V N008 AD8039  ; pins In+ In- V+ V- OUT
C18 N008 N019 2p
XU8 N009 N002 7V -3V N003 AD8039  ; pins In+ In- V+ V- OUT
R26 N002 0 50
R27 N003 N002 450
R28 N008 N020 900
R29 N020 0 100
C19 N008 N020 2p
J7 N050 N056 N059 J113
V11 N054 0 AC 1m
R14 15V N050 2k
R15 15V N053 2k
R16 N051 N057 990
R30 N057 0 10
C6 N056 N055 10µ
R31 N055 N054 50
R32 N056 N060 100Meg
C7 N052 N051 10µ
R33 N052 0 100k
V12 N060 0 0
I3 N059 -15V 10m
XU6 N053 N050 7V -3V N051 AD8039  ; pins In+ In- V+ V- OUT
C20 N051 N057 5p
XU9 N052 N048 7V -3V N049 AD8039  ; pins In+ In- V+ V- OUT
R34 N048 0 50
R35 N049 N048 450
R36 N051 N058 900
R37 N058 0 100
C21 N051 N058 10p
J8 N053 N057 N059 J113
.model D D
.lib standard.dio
.model NPN NPN
.model PNP PNP
.lib standard.bjt
.model NJF NJF
.model PJF PJF
.lib standard.jft
.lib Z:\home\ostoja\Elektronika\LNWBA\LSK389B.lib
;tran 0 1m 0 1n
.lib Z:\home\ostoja\Elektronika\LNWBA\lm7171.lib
.lib Z:\home\ostoja\Elektronika\LNWBA\LM6171A.MOD
.param Trim = 100
;ac dec 100 100 100Meg
.ac dec 100 10 100Meg
* 100x
* 1000x
* 100x
* 1000x
* 100x
* 1000x
* 100x
* 1000x
.lib TL431.lib
.backanno
.end